# EAGLE design rev_5 (EAGLE 5.10)

## Sheet 1 of 3
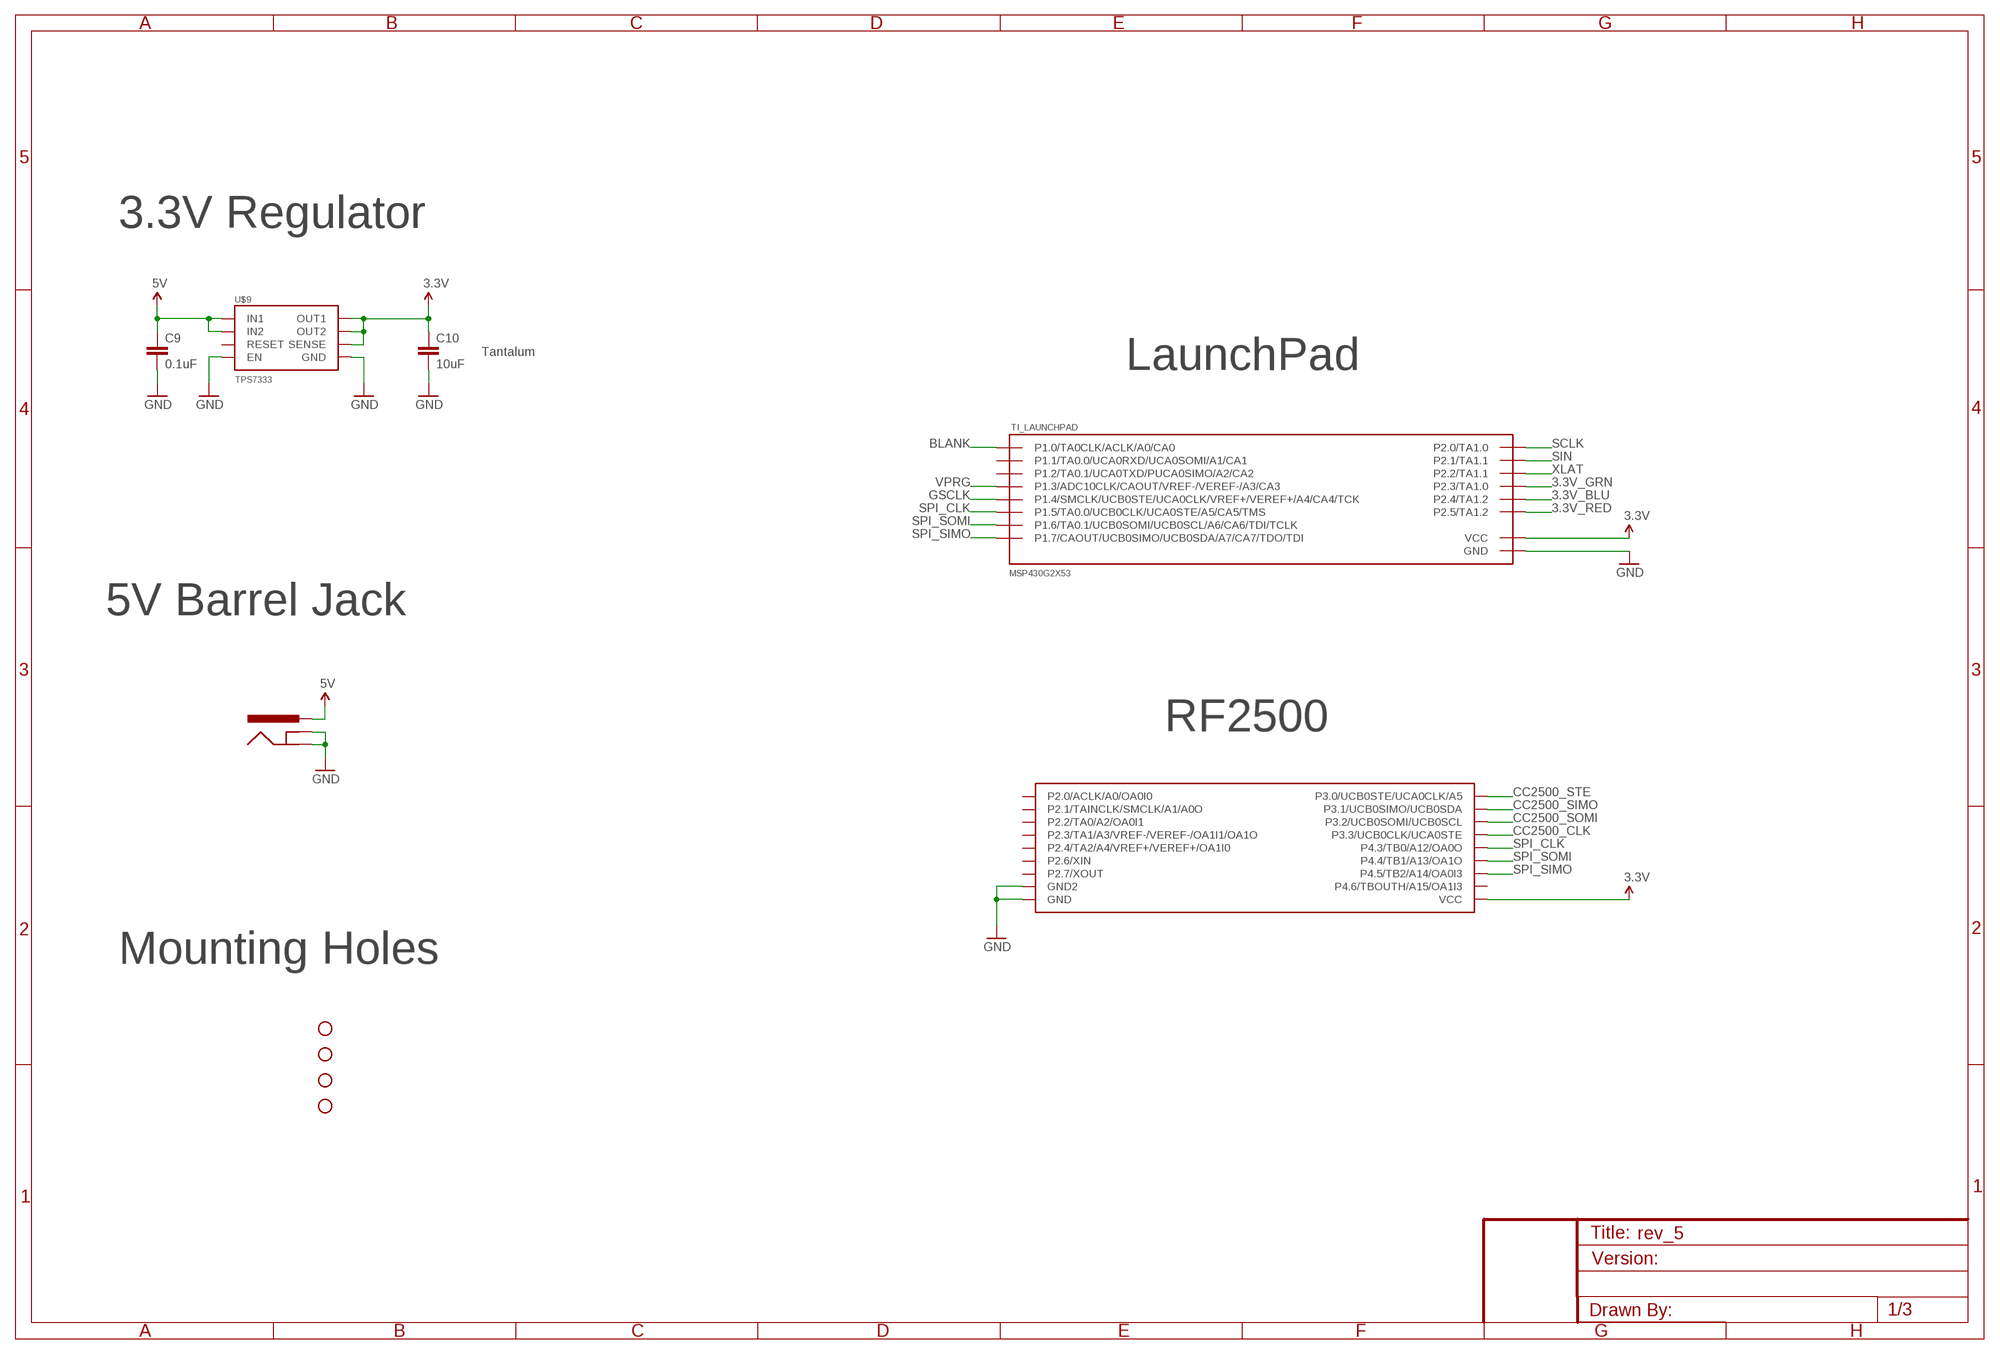
[diagram p0: schematic, sheet 1]

### Parts
C9  0.1uF  CAPPTH  [CAP-PTH-SMALL]
C10  10uF  CAPPTH  [CAP-PTH-SMALL]
JP25  STAND-OFF  [STAND-OFF]
JP26  STAND-OFF  [STAND-OFF]
JP27  STAND-OFF  [STAND-OFF]
JP28  STAND-OFF  [STAND-OFF]
MSP430G2X53  TI_LAUNCHPAD  [TI_LAUNCHPAD]
U$9  TPS7333  [TPS7333]
U$11  CP-102B-ND  [CP-102B-ND]
U$20  RF2500  [RF2500]

### Nets
3.3V: C10.1 MSP430G2X53.VCC U$9.5(OUT1) U$9.6(OUT2) U$9.7(SENSE) U$20.P$2(VCC)
3.3V_BLU: MSP430G2X53.P2.4(P2.4/TA1.2) ; also sheet 3
3.3V_GRN: MSP430G2X53.P2.3(P2.3/TA1.0) ; also sheet 3
3.3V_RED: MSP430G2X53.P2.5(P2.5/TA1.2) ; also sheet 3
5V: C9.1 U$9.3(IN1) U$9.4(IN2) U$11.1(+) ; also sheet 2,3
BLANK: MSP430G2X53.P1.0(P1.0/TA0CLK/ACLK/A0/CA0) ; also sheet 2
CC2500_CLK: U$20.P$16(P3.3/UCB0CLK/UCA0STE)
CC2500_SIMO: U$20.P$18(P3.1/UCB0SIMO/UCB0SDA)
CC2500_SOMI: U$20.P$15(P3.2/UCB0SOMI/UCB0SCL)
CC2500_STE: U$20.P$17(P3.0/UCB0STE/UCA0CLK/A5)
GND: C9.2 C10.2 MSP430G2X53.GND U$9.1(GND) U$9.2(EN) U$11.2(-) U$11.3 U$20.P$1(GND) U$20.P$12(GND2) ; also sheet 2,3
GSCLK: MSP430G2X53.P1.4(P1.4/SMCLK/UCB0STE/UCA0CLK/VREF+/VEREF+/A4/CA4/TCK) ; also sheet 2
SCLK: MSP430G2X53.P2.0(P2.0/TA1.0) ; also sheet 2
SIN: MSP430G2X53.P2.1(P2.1/TA1.1) ; also sheet 2
SPI_CLK: MSP430G2X53.P1.5(P1.5/TA0.0/UCB0CLK/UCA0STE/A5/CA5/TMS) U$20.P$8(P4.3/TB0/A12/OA0O)
SPI_SIMO: MSP430G2X53.P1.7(P1.7/CAOUT/UCB0SIMO/UCB0SDA/A7/CA7/TDO/TDI) U$20.P$10(P4.5/TB2/A14/OA0I3)
SPI_SOMI: MSP430G2X53.P1.6(P1.6/TA0.1/UCB0SOMI/UCB0SCL/A6/CA6/TDI/TCLK) U$20.P$9(P4.4/TB1/A13/OA1O)
VPRG: MSP430G2X53.P1.3(P1.3/ADC10CLK/CAOUT/VREF-/VEREF-/A3/CA3) ; also sheet 2
XLAT: MSP430G2X53.P2.2(P2.2/TA1.1) ; also sheet 2
Unconnected: MSP430G2X53.P1.1(P1.1/TA0.0/UCA0RXD/UCA0SOMI/A1/CA1) MSP430G2X53.P1.2(P1.2/TA0.1/UCA0TXD/PUCA0SIMO/A2/CA2) U$9.8(RESET) U$20.P$3(P2.0/ACLK/A0/OA0I0) U$20.P$4(P2.1/TAINCLK/SMCLK/A1/A0O) U$20.P$5(P2.2/TA0/A2/OA0I1) U$20.P$6(P2.3/TA1/A3/VREF-/VEREF-/OA1I1/OA1O) U$20.P$7(P2.4/TA2/A4/VREF+/VEREF+/OA1I0) U$20.P$11(P4.6/TBOUTH/A15/OA1I3) U$20.P$13(P2.6/XIN) U$20.P$14(P2.7/XOUT)

### Notes on the sheet
- 3.3V Regulator
- Tantalum
- LaunchPad
- 5V Barrel Jack
- RF2500
- Mounting Holes

## Sheet 2 of 3
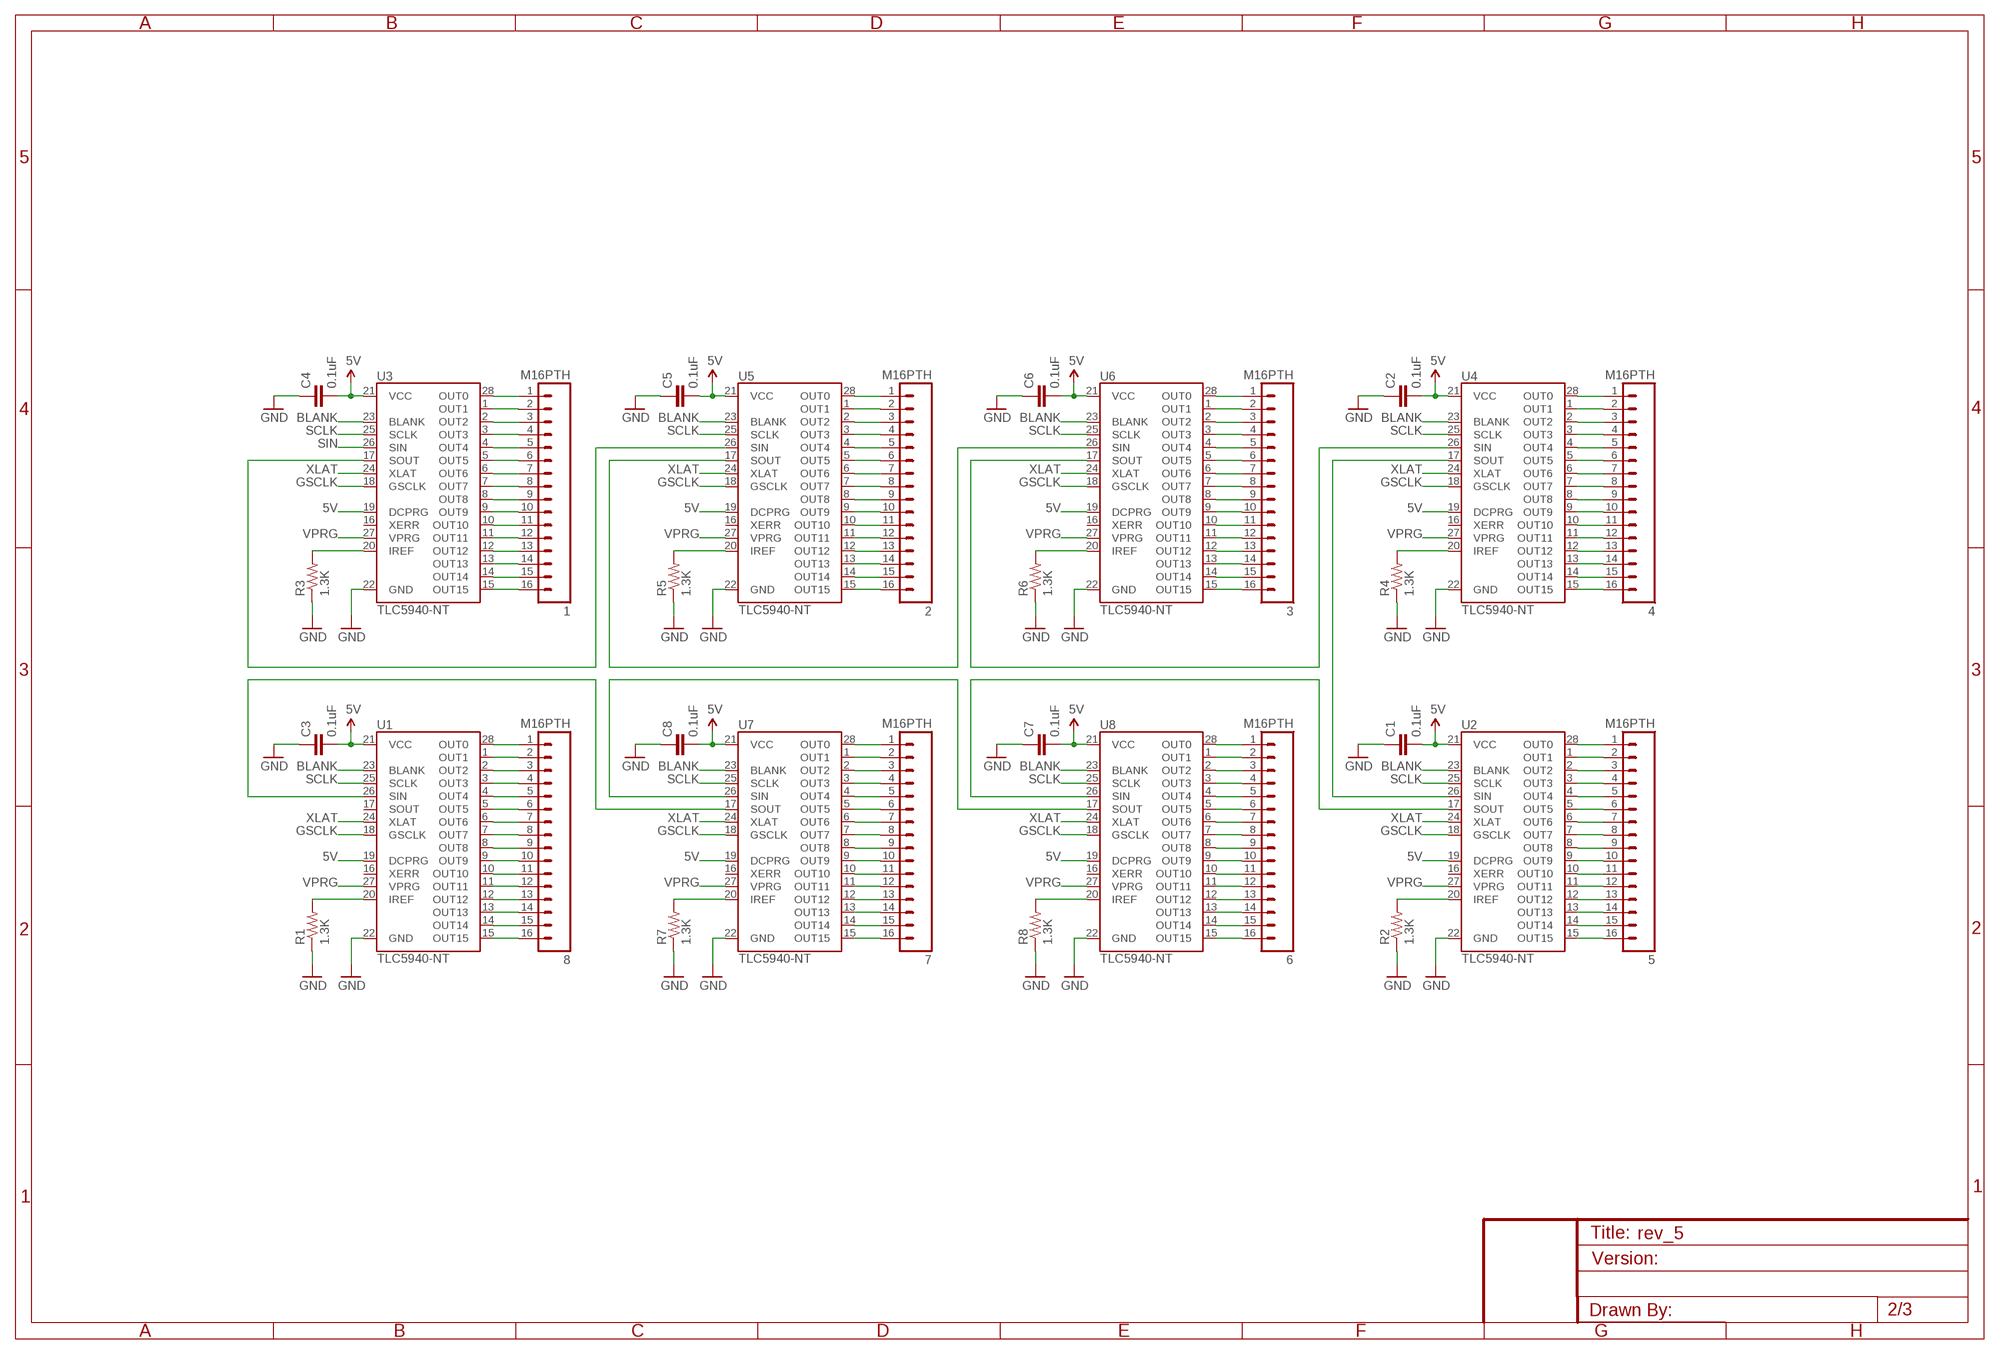
[diagram p1: schematic, sheet 2]

### Parts
1  M16PTH  [1X16]
2  M16PTH  [1X16]
3  M16PTH  [1X16]
4  M16PTH  [1X16]
5  M16PTH  [1X16]
6  M16PTH  [1X16]
7  M16PTH  [1X16]
8  M16PTH  [1X16]
C1  0.1uF  CAPPTH  [CAP-PTH-SMALL]
C2  0.1uF  CAPPTH  [CAP-PTH-SMALL]
C3  0.1uF  CAPPTH  [CAP-PTH-SMALL]
C4  0.1uF  CAPPTH  [CAP-PTH-SMALL]
C5  0.1uF  CAPPTH  [CAP-PTH-SMALL]
C6  0.1uF  CAPPTH  [CAP-PTH-SMALL]
C7  0.1uF  CAPPTH  [CAP-PTH-SMALL]
C8  0.1uF  CAPPTH  [CAP-PTH-SMALL]
R1  1.3K  RESISTORPTH-1/6W  [1/6W-RES]
R2  1.3K  RESISTORPTH-1/6W  [1/6W-RES]
R3  1.3K  RESISTORPTH-1/6W  [1/6W-RES]
R4  1.3K  RESISTORPTH-1/6W  [1/6W-RES]
R5  1.3K  RESISTORPTH-1/6W  [1/6W-RES]
R6  1.3K  RESISTORPTH-1/6W  [1/6W-RES]
R7  1.3K  RESISTORPTH-1/6W  [1/6W-RES]
R8  1.3K  RESISTORPTH-1/6W  [1/6W-RES]
U1  TLC5940-NT  [DIL28-3]
U2  TLC5940-NT  [DIL28-3]
U3  TLC5940-NT  [DIL28-3]
U4  TLC5940-NT  [DIL28-3]
U5  TLC5940-NT  [DIL28-3]
U6  TLC5940-NT  [DIL28-3]
U7  TLC5940-NT  [DIL28-3]
U8  TLC5940-NT  [DIL28-3]

### Nets
5V: C1.2 C2.2 C3.2 C4.2 C5.2 C6.2 C7.2 C8.2 U1.19(DCPRG) U1.21(VCC) U2.19(DCPRG) U2.21(VCC) U3.19(DCPRG) U3.21(VCC) U4.19(DCPRG) U4.21(VCC) U5.19(DCPRG) U5.21(VCC) U6.19(DCPRG) U6.21(VCC) U7.19(DCPRG) U7.21(VCC) U8.19(DCPRG) U8.21(VCC) ; also sheet 1,3
BLANK: U1.23(BLANK) U2.23(BLANK) U3.23(BLANK) U4.23(BLANK) U5.23(BLANK) U6.23(BLANK) U7.23(BLANK) U8.23(BLANK) ; also sheet 1
GND: C1.1 C2.1 C3.1 C4.1 C5.1 C6.1 C7.1 C8.1 R1.1 R2.1 R3.1 R4.1 R5.1 R6.1 R7.1 R8.1 U1.22(GND) U2.22(GND) U3.22(GND) U4.22(GND) U5.22(GND) U6.22(GND) U7.22(GND) U8.22(GND) ; also sheet 1,3
GSCLK: U1.18(GSCLK) U2.18(GSCLK) U3.18(GSCLK) U4.18(GSCLK) U5.18(GSCLK) U6.18(GSCLK) U7.18(GSCLK) U8.18(GSCLK) ; also sheet 1
N$1: 8.1 U1.28(OUT0)
N$2: 8.2 U1.1(OUT1)
N$3: 8.3 U1.2(OUT2)
N$4: 8.4 U1.3(OUT3)
N$5: 8.5 U1.4(OUT4)
N$6: 8.6 U1.5(OUT5)
N$7: 8.7 U1.6(OUT6)
N$8: 8.8 U1.7(OUT7)
N$9: 8.9 U1.8(OUT8)
N$10: 8.10 U1.9(OUT9)
N$11: 8.11 U1.10(OUT10)
N$12: 8.12 U1.11(OUT11)
N$13: 8.13 U1.12(OUT12)
N$14: 8.14 U1.13(OUT13)
N$15: 8.15 U1.14(OUT14)
N$16: 8.16 U1.15(OUT15)
N$17: R1.2 U1.20(IREF)
N$18: R2.2 U2.20(IREF)
N$19: 5.1 U2.28(OUT0)
N$20: 5.2 U2.1(OUT1)
N$23: 5.3 U2.2(OUT2)
N$24: 5.4 U2.3(OUT3)
N$25: 5.5 U2.4(OUT4)
N$26: 5.6 U2.5(OUT5)
N$27: 5.7 U2.6(OUT6)
N$28: 5.8 U2.7(OUT7)
N$29: 5.9 U2.8(OUT8)
N$30: 5.10 U2.9(OUT9)
N$31: 5.11 U2.10(OUT10)
N$32: 5.12 U2.11(OUT11)
N$33: 5.13 U2.12(OUT12)
N$34: 5.14 U2.13(OUT13)
N$35: 5.15 U2.14(OUT14)
N$36: 5.16 U2.15(OUT15)
N$37: U3.17(SOUT) U5.26(SIN)
N$38: U5.17(SOUT) U6.26(SIN)
N$39: R3.2 U3.20(IREF)
N$40: 1.1 U3.28(OUT0)
N$41: 1.2 U3.1(OUT1)
N$42: 1.3 U3.2(OUT2)
N$43: 1.4 U3.3(OUT3)
N$44: 1.5 U3.4(OUT4)
N$45: 1.6 U3.5(OUT5)
N$46: 1.7 U3.6(OUT6)
N$47: 1.8 U3.7(OUT7)
N$48: 1.9 U3.8(OUT8)
N$49: 1.10 U3.9(OUT9)
N$50: 1.11 U3.10(OUT10)
N$51: 1.12 U3.11(OUT11)
N$52: 1.13 U3.12(OUT12)
N$53: 1.14 U3.13(OUT13)
N$54: 1.15 U3.14(OUT14)
N$55: 1.16 U3.15(OUT15)
N$56: U4.26(SIN) U6.17(SOUT)
N$57: U2.26(SIN) U4.17(SOUT)
N$58: R4.2 U4.20(IREF)
N$59: 4.1 U4.28(OUT0)
N$60: 4.2 U4.1(OUT1)
N$61: 4.3 U4.2(OUT2)
N$62: 4.4 U4.3(OUT3)
N$63: 4.5 U4.4(OUT4)
N$64: 4.6 U4.5(OUT5)
N$65: 4.7 U4.6(OUT6)
N$66: 4.8 U4.7(OUT7)
N$67: 4.9 U4.8(OUT8)
N$68: 4.10 U4.9(OUT9)
N$69: 4.11 U4.10(OUT10)
N$70: 4.12 U4.11(OUT11)
N$71: 4.13 U4.12(OUT12)
N$72: 4.14 U4.13(OUT13)
N$73: 4.15 U4.14(OUT14)
N$74: 4.16 U4.15(OUT15)
N$75: U2.17(SOUT) U8.26(SIN)
N$77: R5.2 U5.20(IREF)
N$78: 2.1 U5.28(OUT0)
N$79: 2.2 U5.1(OUT1)
N$80: 2.3 U5.2(OUT2)
N$81: 2.4 U5.3(OUT3)
N$82: 2.5 U5.4(OUT4)
N$83: 2.6 U5.5(OUT5)
N$84: 2.7 U5.6(OUT6)
N$85: 2.8 U5.7(OUT7)
N$86: 2.9 U5.8(OUT8)
N$87: 2.10 U5.9(OUT9)
N$88: 2.11 U5.10(OUT10)
N$89: 2.12 U5.11(OUT11)
N$90: 2.13 U5.12(OUT12)
N$91: 2.14 U5.13(OUT13)
N$92: 2.15 U5.14(OUT14)
N$93: 2.16 U5.15(OUT15)
N$94: U7.26(SIN) U8.17(SOUT)
N$95: U1.26(SIN) U7.17(SOUT)
N$96: R6.2 U6.20(IREF)
N$97: 3.1 U6.28(OUT0)
N$98: 3.2 U6.1(OUT1)
N$99: 3.3 U6.2(OUT2)
N$100: 3.4 U6.3(OUT3)
N$101: 3.5 U6.4(OUT4)
N$102: 3.6 U6.5(OUT5)
N$103: 3.7 U6.6(OUT6)
N$104: 3.8 U6.7(OUT7)
N$105: 3.9 U6.8(OUT8)
N$106: 3.10 U6.9(OUT9)
N$107: 3.11 U6.10(OUT10)
N$108: 3.12 U6.11(OUT11)
N$109: 3.13 U6.12(OUT12)
N$110: 3.14 U6.13(OUT13)
N$111: 3.15 U6.14(OUT14)
N$112: 3.16 U6.15(OUT15)
N$115: R7.2 U7.20(IREF)
N$116: 7.1 U7.28(OUT0)
N$117: 7.2 U7.1(OUT1)
N$118: 7.3 U7.2(OUT2)
N$119: 7.4 U7.3(OUT3)
N$120: 7.5 U7.4(OUT4)
N$121: 7.6 U7.5(OUT5)
N$122: 7.7 U7.6(OUT6)
N$123: 7.8 U7.7(OUT7)
N$124: 7.9 U7.8(OUT8)
N$125: 7.10 U7.9(OUT9)
N$126: 7.11 U7.10(OUT10)
N$127: 7.12 U7.11(OUT11)
N$128: 7.13 U7.12(OUT12)
N$129: 7.14 U7.13(OUT13)
N$130: 7.15 U7.14(OUT14)
N$131: 7.16 U7.15(OUT15)
N$134: R8.2 U8.20(IREF)
N$135: 6.1 U8.28(OUT0)
N$136: 6.2 U8.1(OUT1)
N$137: 6.3 U8.2(OUT2)
N$138: 6.4 U8.3(OUT3)
N$139: 6.5 U8.4(OUT4)
N$140: 6.6 U8.5(OUT5)
N$141: 6.7 U8.6(OUT6)
N$142: 6.8 U8.7(OUT7)
N$143: 6.9 U8.8(OUT8)
N$144: 6.10 U8.9(OUT9)
N$145: 6.11 U8.10(OUT10)
N$146: 6.12 U8.11(OUT11)
N$147: 6.13 U8.12(OUT12)
N$148: 6.14 U8.13(OUT13)
N$149: 6.15 U8.14(OUT14)
N$150: 6.16 U8.15(OUT15)
SCLK: U1.25(SCLK) U2.25(SCLK) U3.25(SCLK) U4.25(SCLK) U5.25(SCLK) U6.25(SCLK) U7.25(SCLK) U8.25(SCLK) ; also sheet 1
SIN: U3.26(SIN) ; also sheet 1
VPRG: U1.27(VPRG) U2.27(VPRG) U3.27(VPRG) U4.27(VPRG) U5.27(VPRG) U6.27(VPRG) U7.27(VPRG) U8.27(VPRG) ; also sheet 1
XLAT: U1.24(XLAT) U2.24(XLAT) U3.24(XLAT) U4.24(XLAT) U5.24(XLAT) U6.24(XLAT) U7.24(XLAT) U8.24(XLAT) ; also sheet 1
Unconnected: U1.16(XERR) U1.17(SOUT) U2.16(XERR) U3.16(XERR) U4.16(XERR) U5.16(XERR) U6.16(XERR) U7.16(XERR) U8.16(XERR)

## Sheet 3 of 3
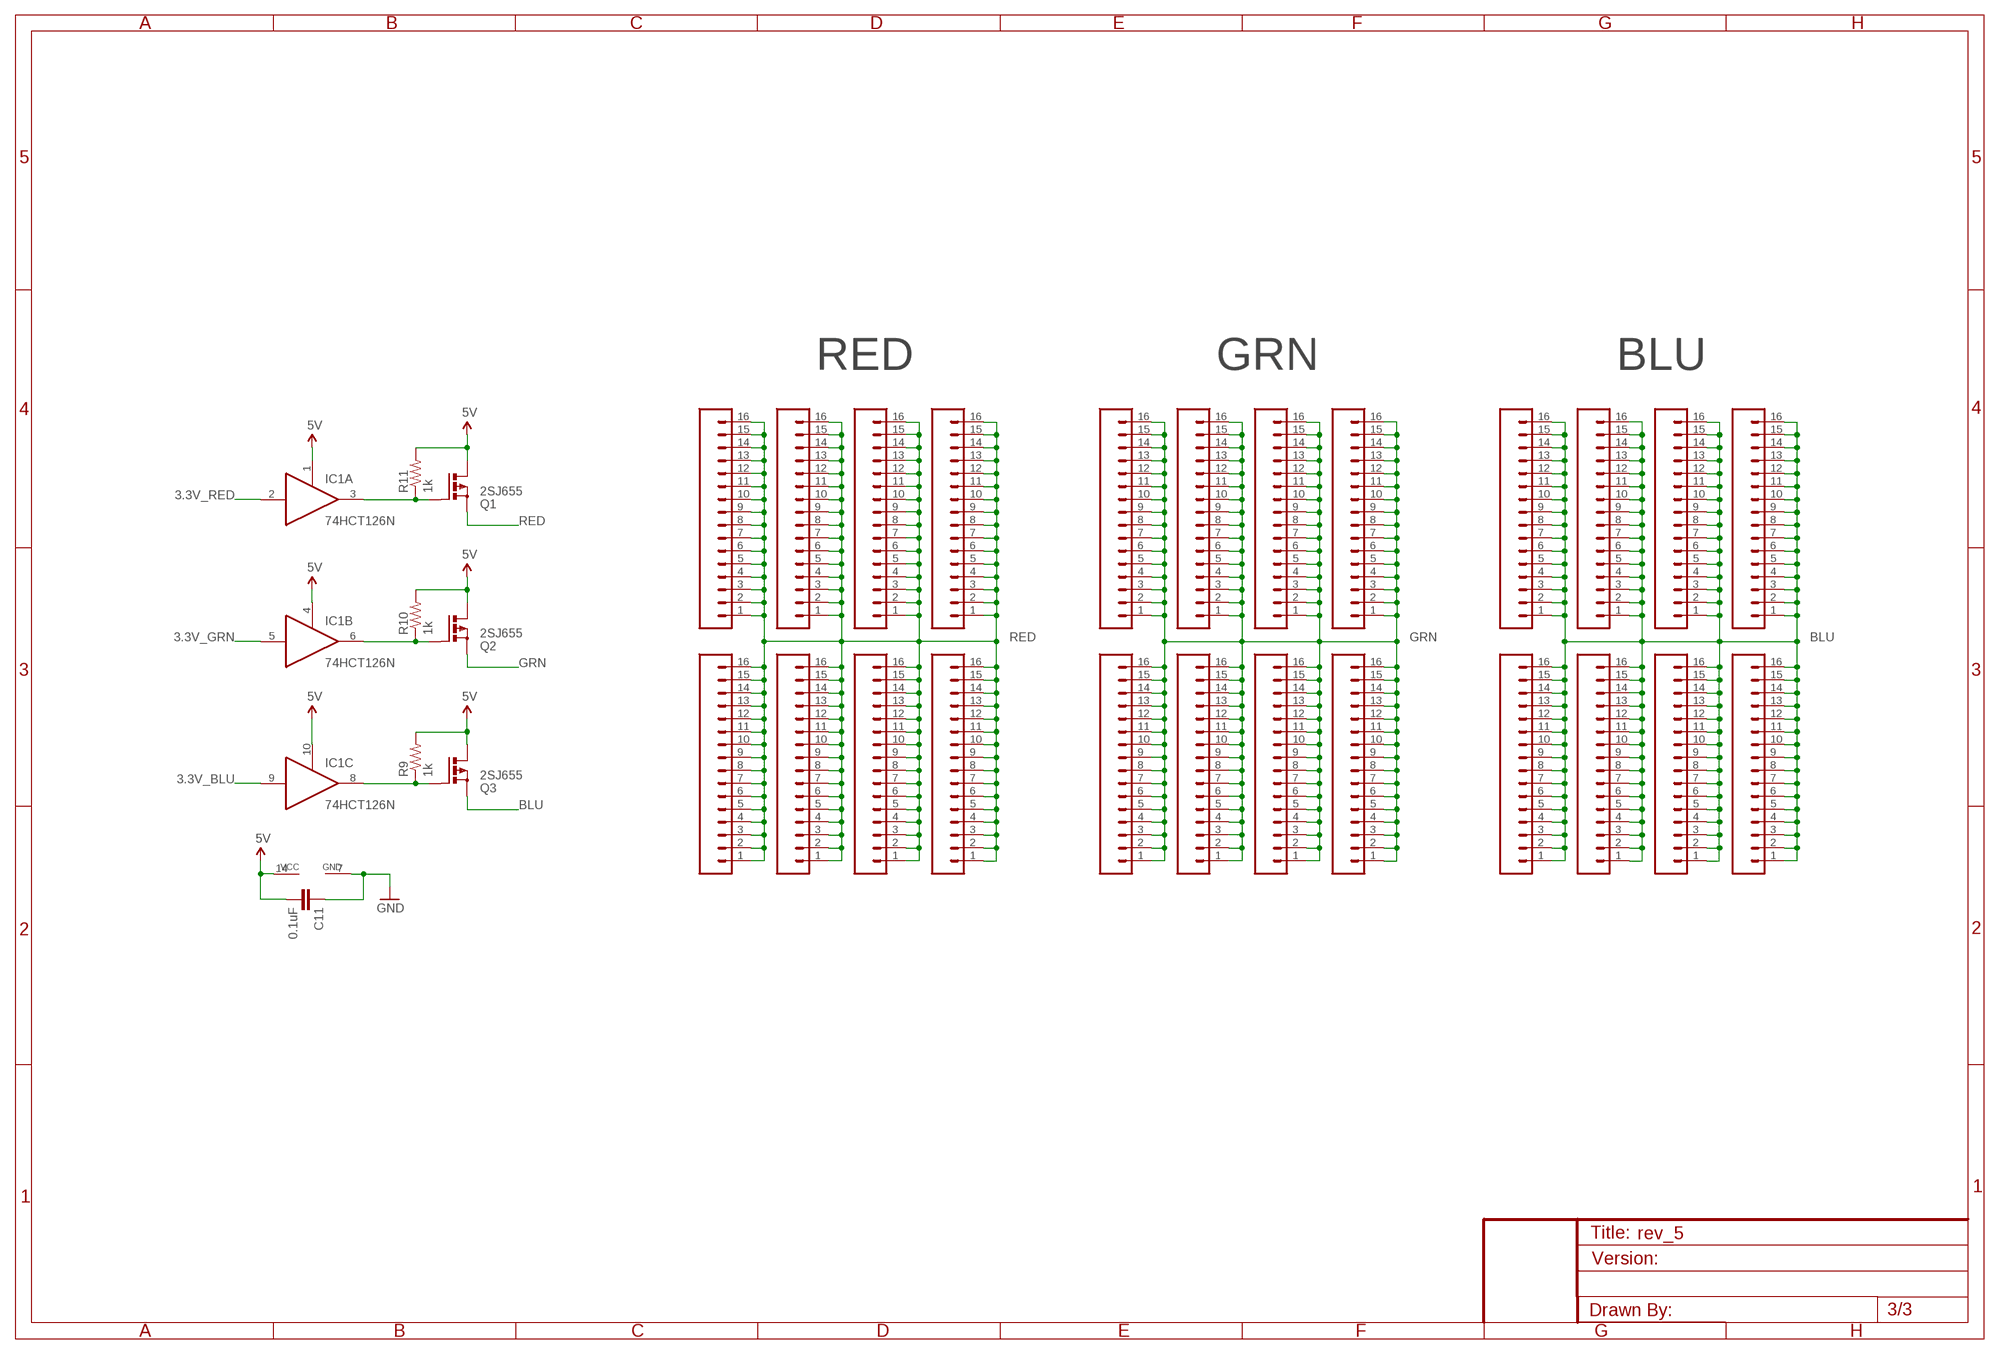
[diagram p2: schematic, sheet 3]

### Parts
C11  0.1uF  CAPPTH  [CAP-PTH-SMALL]
IC1  74HCT126N  [DIL14]
JP1  M16PTH  [1X16]
JP2  M16PTH  [1X16]
JP3  M16PTH  [1X16]
JP4  M16PTH  [1X16]
JP5  M16PTH  [1X16]
JP6  M16PTH  [1X16]
JP7  M16PTH  [1X16]
JP8  M16PTH  [1X16]
JP9  M16PTH  [1X16]
JP10  M16PTH  [1X16]
JP11  M16PTH  [1X16]
JP12  M16PTH  [1X16]
JP13  M16PTH  [1X16]
JP14  M16PTH  [1X16]
JP15  M16PTH  [1X16]
JP16  M16PTH  [1X16]
JP17  M16PTH  [1X16]
JP18  M16PTH  [1X16]
JP19  M16PTH  [1X16]
JP20  M16PTH  [1X16]
JP21  M16PTH  [1X16]
JP22  M16PTH  [1X16]
JP23  M16PTH  [1X16]
JP24  M16PTH  [1X16]
Q1  2SJ655  PMOSFET_PTO220BV  [TO220BV]
Q2  2SJ655  PMOSFET_PTO220BV  [TO220BV]
Q3  2SJ655  PMOSFET_PTO220BV  [TO220BV]
R9  1k  RESISTORPTH-1/6W  [1/6W-RES]
R10  1k  RESISTORPTH-1/6W  [1/6W-RES]
R11  1k  RESISTORPTH-1/6W  [1/6W-RES]

### Nets
3.3V_BLU: IC1.9(C:I) ; also sheet 1
3.3V_GRN: IC1.5(B:I) ; also sheet 1
3.3V_RED: IC1.2(A:I) ; also sheet 1
5V: C11.2 IC1.1(A:OE) IC1.4(B:OE) IC1.10(C:OE) IC1.14(P:VCC) Q1.D Q2.D Q3.D R9.2 R10.2 R11.2 ; also sheet 1,2
BLU: JP1.1 JP1.2 JP1.3 JP1.4 JP1.5 JP1.6 JP1.7 JP1.8 JP1.9 JP1.10 JP1.11 JP1.12 JP1.13 JP1.14 JP1.15 JP1.16 JP4.1 JP4.2 JP4.3 JP4.4 JP4.5 JP4.6 JP4.7 JP4.8 JP4.9 JP4.10 JP4.11 JP4.12 JP4.13 JP4.14 JP4.15 JP4.16 JP7.1 JP7.2 JP7.3 JP7.4 JP7.5 JP7.6 JP7.7 JP7.8 JP7.9 JP7.10 JP7.11 JP7.12 JP7.13 JP7.14 JP7.15 JP7.16 JP10.1 JP10.2 JP10.3 JP10.4 JP10.5 JP10.6 JP10.7 JP10.8 JP10.9 JP10.10 JP10.11 JP10.12 JP10.13 JP10.14 JP10.15 JP10.16 JP13.1 JP13.2 JP13.3 JP13.4 JP13.5 JP13.6 JP13.7 JP13.8 JP13.9 JP13.10 JP13.11 JP13.12 JP13.13 JP13.14 JP13.15 JP13.16 JP16.1 JP16.2 JP16.3 JP16.4 JP16.5 JP16.6 JP16.7 JP16.8 JP16.9 JP16.10 JP16.11 JP16.12 JP16.13 JP16.14 JP16.15 JP16.16 JP20.1 JP20.2 JP20.3 JP20.4 JP20.5 JP20.6 JP20.7 JP20.8 JP20.9 JP20.10 JP20.11 JP20.12 JP20.13 JP20.14 JP20.15 JP20.16 JP23.1 JP23.2 JP23.3 JP23.4 JP23.5 JP23.6 JP23.7 JP23.8 JP23.9 JP23.10 JP23.11 JP23.12 JP23.13 JP23.14 JP23.15 JP23.16 Q3.S
GND: C11.1 IC1.7(P:GND) ; also sheet 1,2
GRN: JP2.1 JP2.2 JP2.3 JP2.4 JP2.5 JP2.6 JP2.7 JP2.8 JP2.9 JP2.10 JP2.11 JP2.12 JP2.13 JP2.14 JP2.15 JP2.16 JP5.1 JP5.2 JP5.3 JP5.4 JP5.5 JP5.6 JP5.7 JP5.8 JP5.9 JP5.10 JP5.11 JP5.12 JP5.13 JP5.14 JP5.15 JP5.16 JP8.1 JP8.2 JP8.3 JP8.4 JP8.5 JP8.6 JP8.7 JP8.8 JP8.9 JP8.10 JP8.11 JP8.12 JP8.13 JP8.14 JP8.15 JP8.16 JP11.1 JP11.2 JP11.3 JP11.4 JP11.5 JP11.6 JP11.7 JP11.8 JP11.9 JP11.10 JP11.11 JP11.12 JP11.13 JP11.14 JP11.15 JP11.16 JP14.1 JP14.2 JP14.3 JP14.4 JP14.5 JP14.6 JP14.7 JP14.8 JP14.9 JP14.10 JP14.11 JP14.12 JP14.13 JP14.14 JP14.15 JP14.16 JP17.1 JP17.2 JP17.3 JP17.4 JP17.5 JP17.6 JP17.7 JP17.8 JP17.9 JP17.10 JP17.11 JP17.12 JP17.13 JP17.14 JP17.15 JP17.16 JP19.1 JP19.2 JP19.3 JP19.4 JP19.5 JP19.6 JP19.7 JP19.8 JP19.9 JP19.10 JP19.11 JP19.12 JP19.13 JP19.14 JP19.15 JP19.16 JP22.1 JP22.2 JP22.3 JP22.4 JP22.5 JP22.6 JP22.7 JP22.8 JP22.9 JP22.10 JP22.11 JP22.12 JP22.13 JP22.14 JP22.15 JP22.16 Q2.S
N$113: IC1.3(A:O) Q1.G R11.1
N$114: IC1.6(B:O) Q2.G R10.1
N$132: IC1.8(C:O) Q3.G R9.1
RED: JP3.1 JP3.2 JP3.3 JP3.4 JP3.5 JP3.6 JP3.7 JP3.8 JP3.9 JP3.10 JP3.11 JP3.12 JP3.13 JP3.14 JP3.15 JP3.16 JP6.1 JP6.2 JP6.3 JP6.4 JP6.5 JP6.6 JP6.7 JP6.8 JP6.9 JP6.10 JP6.11 JP6.12 JP6.13 JP6.14 JP6.15 JP6.16 JP9.1 JP9.2 JP9.3 JP9.4 JP9.5 JP9.6 JP9.7 JP9.8 JP9.9 JP9.10 JP9.11 JP9.12 JP9.13 JP9.14 JP9.15 JP9.16 JP12.1 JP12.2 JP12.3 JP12.4 JP12.5 JP12.6 JP12.7 JP12.8 JP12.9 JP12.10 JP12.11 JP12.12 JP12.13 JP12.14 JP12.15 JP12.16 JP15.1 JP15.2 JP15.3 JP15.4 JP15.5 JP15.6 JP15.7 JP15.8 JP15.9 JP15.10 JP15.11 JP15.12 JP15.13 JP15.14 JP15.15 JP15.16 JP18.1 JP18.2 JP18.3 JP18.4 JP18.5 JP18.6 JP18.7 JP18.8 JP18.9 JP18.10 JP18.11 JP18.12 JP18.13 JP18.14 JP18.15 JP18.16 JP21.1 JP21.2 JP21.3 JP21.4 JP21.5 JP21.6 JP21.7 JP21.8 JP21.9 JP21.10 JP21.11 JP21.12 JP21.13 JP21.14 JP21.15 JP21.16 JP24.1 JP24.2 JP24.3 JP24.4 JP24.5 JP24.6 JP24.7 JP24.8 JP24.9 JP24.10 JP24.11 JP24.12 JP24.13 JP24.14 JP24.15 JP24.16 Q1.S
Unconnected: IC1.11(D:O) IC1.12(D:I) IC1.13(D:OE)

### Notes on the sheet
- RED | GRN | BLU

## Library data of the parts
1-8 JP1-JP24 = SparkFun:M16
C1-C11 = SparkFun:CAP: Capacitor Standard 0603 ceramic capacitor, and 0.1" leaded capacitor.
IC1 = 74xx-eu:74*126: Quad bus BUFFER, 3-state
JP25-JP28 = SparkFun:STAND-OFF: Stand Off This is the mechanical footprint for a #4 phillips button head screw. Use the keepout ring to avoid running the screw head into surrounding components. SKU : PRT-00447
MSP430G2X53 = launchpad_comp:TI_LAUNCHPAD
Q1-Q3 = transistor-power:PMOSFET_P: Power MOSFET P-Channel
R1-R11 = SparkFun:RESISTOR: Resistor Basic schematic elements and footprints for 0603, 1206, and PTH resistors.
U1-U8 = SparkFun:TLC5940: TI TLC5940 16-channel LED Driver with Dot Correction and Grayscale PWM Control The TLC5940 is a 16-channel, constant-current sink LED driver. Each channel has an individually adjustable 4096-step grayscale PWM brightness control and a 64-step, constant-current sink (dot correction). The dot correction adjusts the brightness variations between LED channels and other LED drivers. The dot correction data is stored in an integrated EEPROM. Both grayscale control and dot correction are accessible via a serial interface. A single external resistor sets the maximum current value of all 16 channels. Packages: 28-pin HTSSOP 32-pin 5x5mm QFN 28-pin DIP
U$9 = launchpad_comp:TPS7333
U$11 = launchpad_comp:CP-102B-ND
U$20 = launchpad_comp:RF2500

## Board
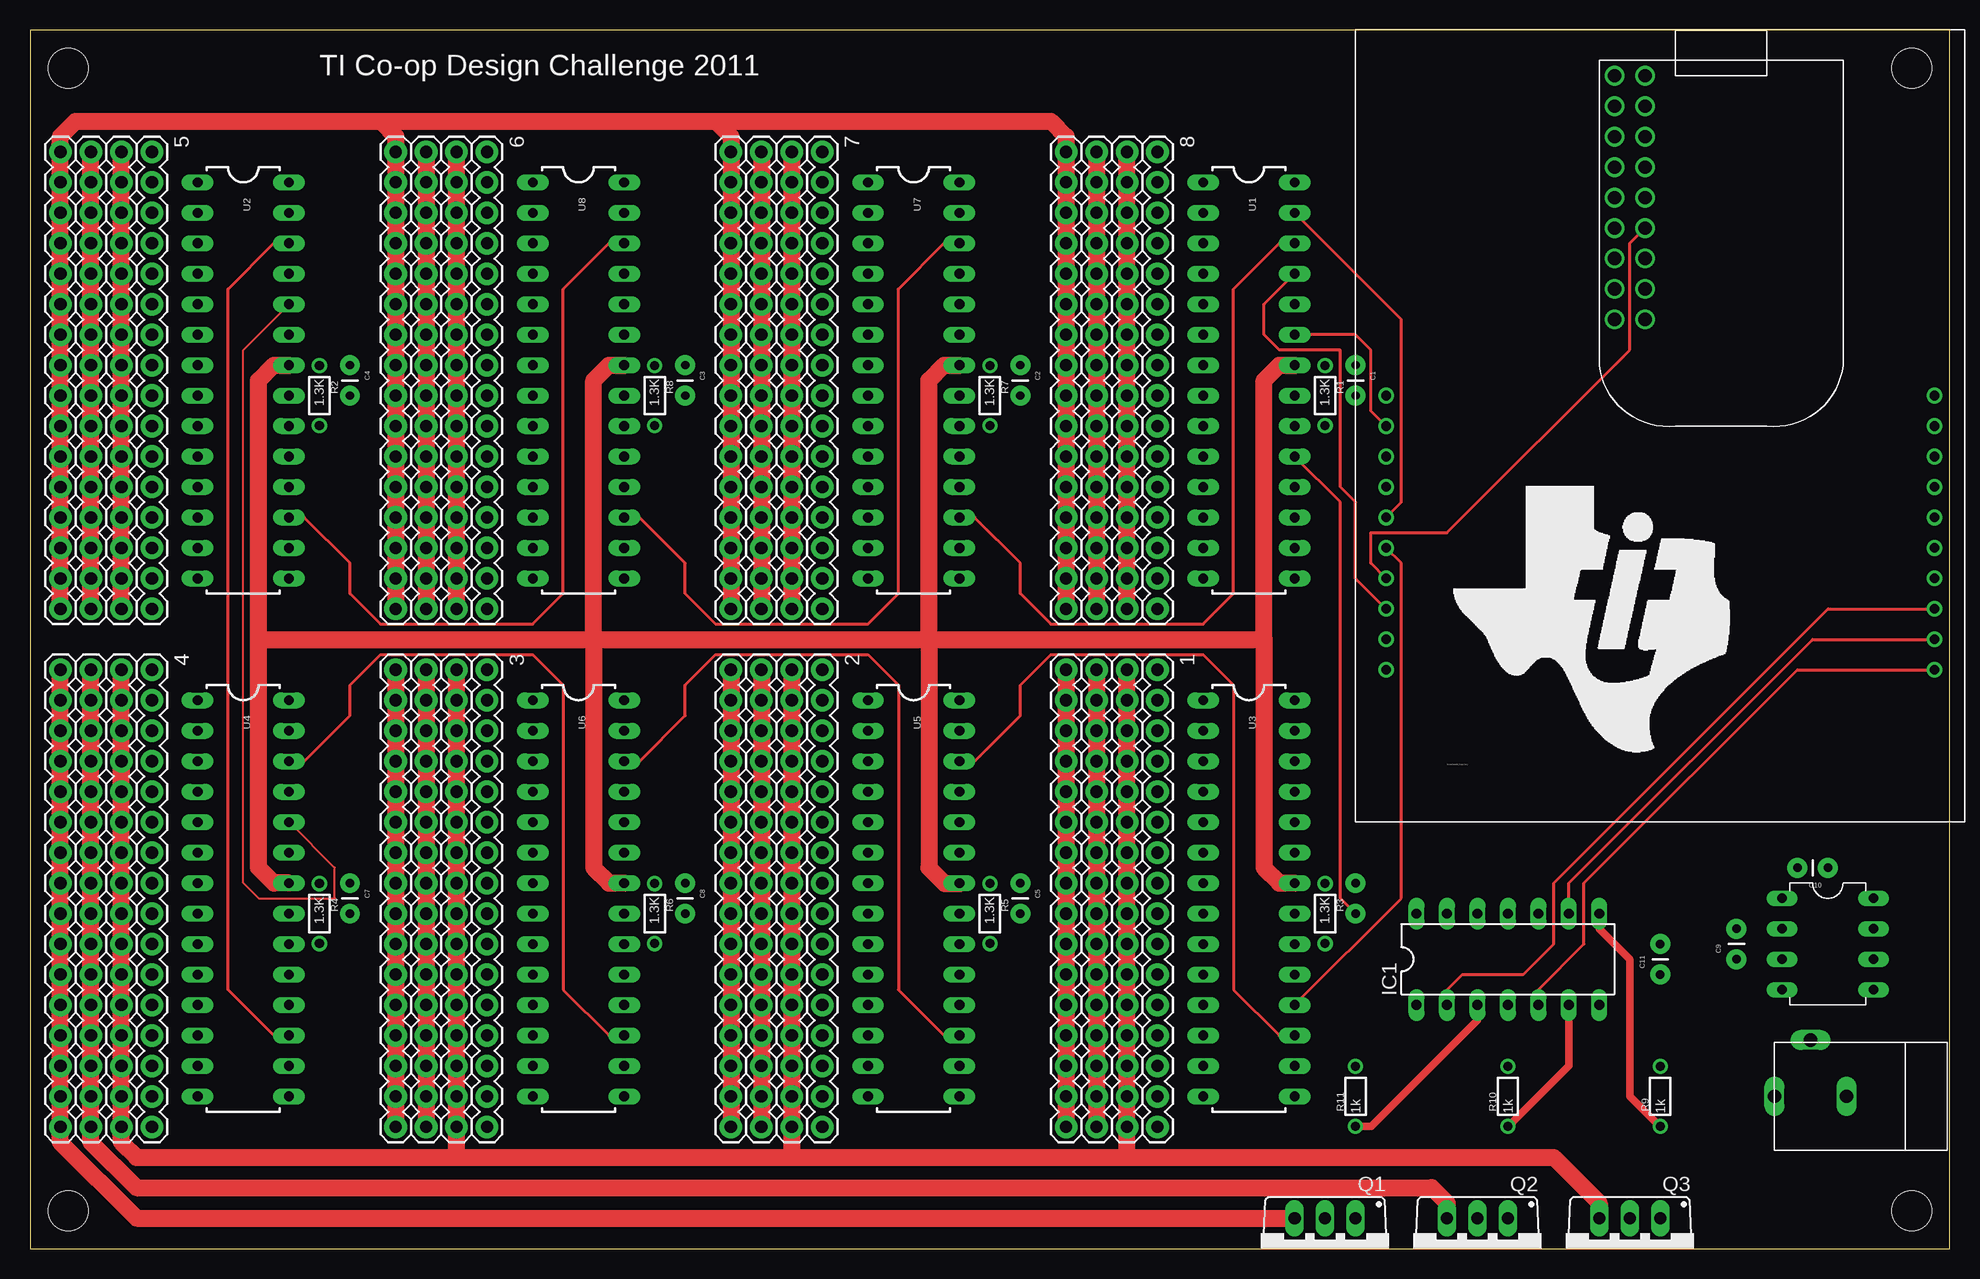
[diagram p3: board, top side]
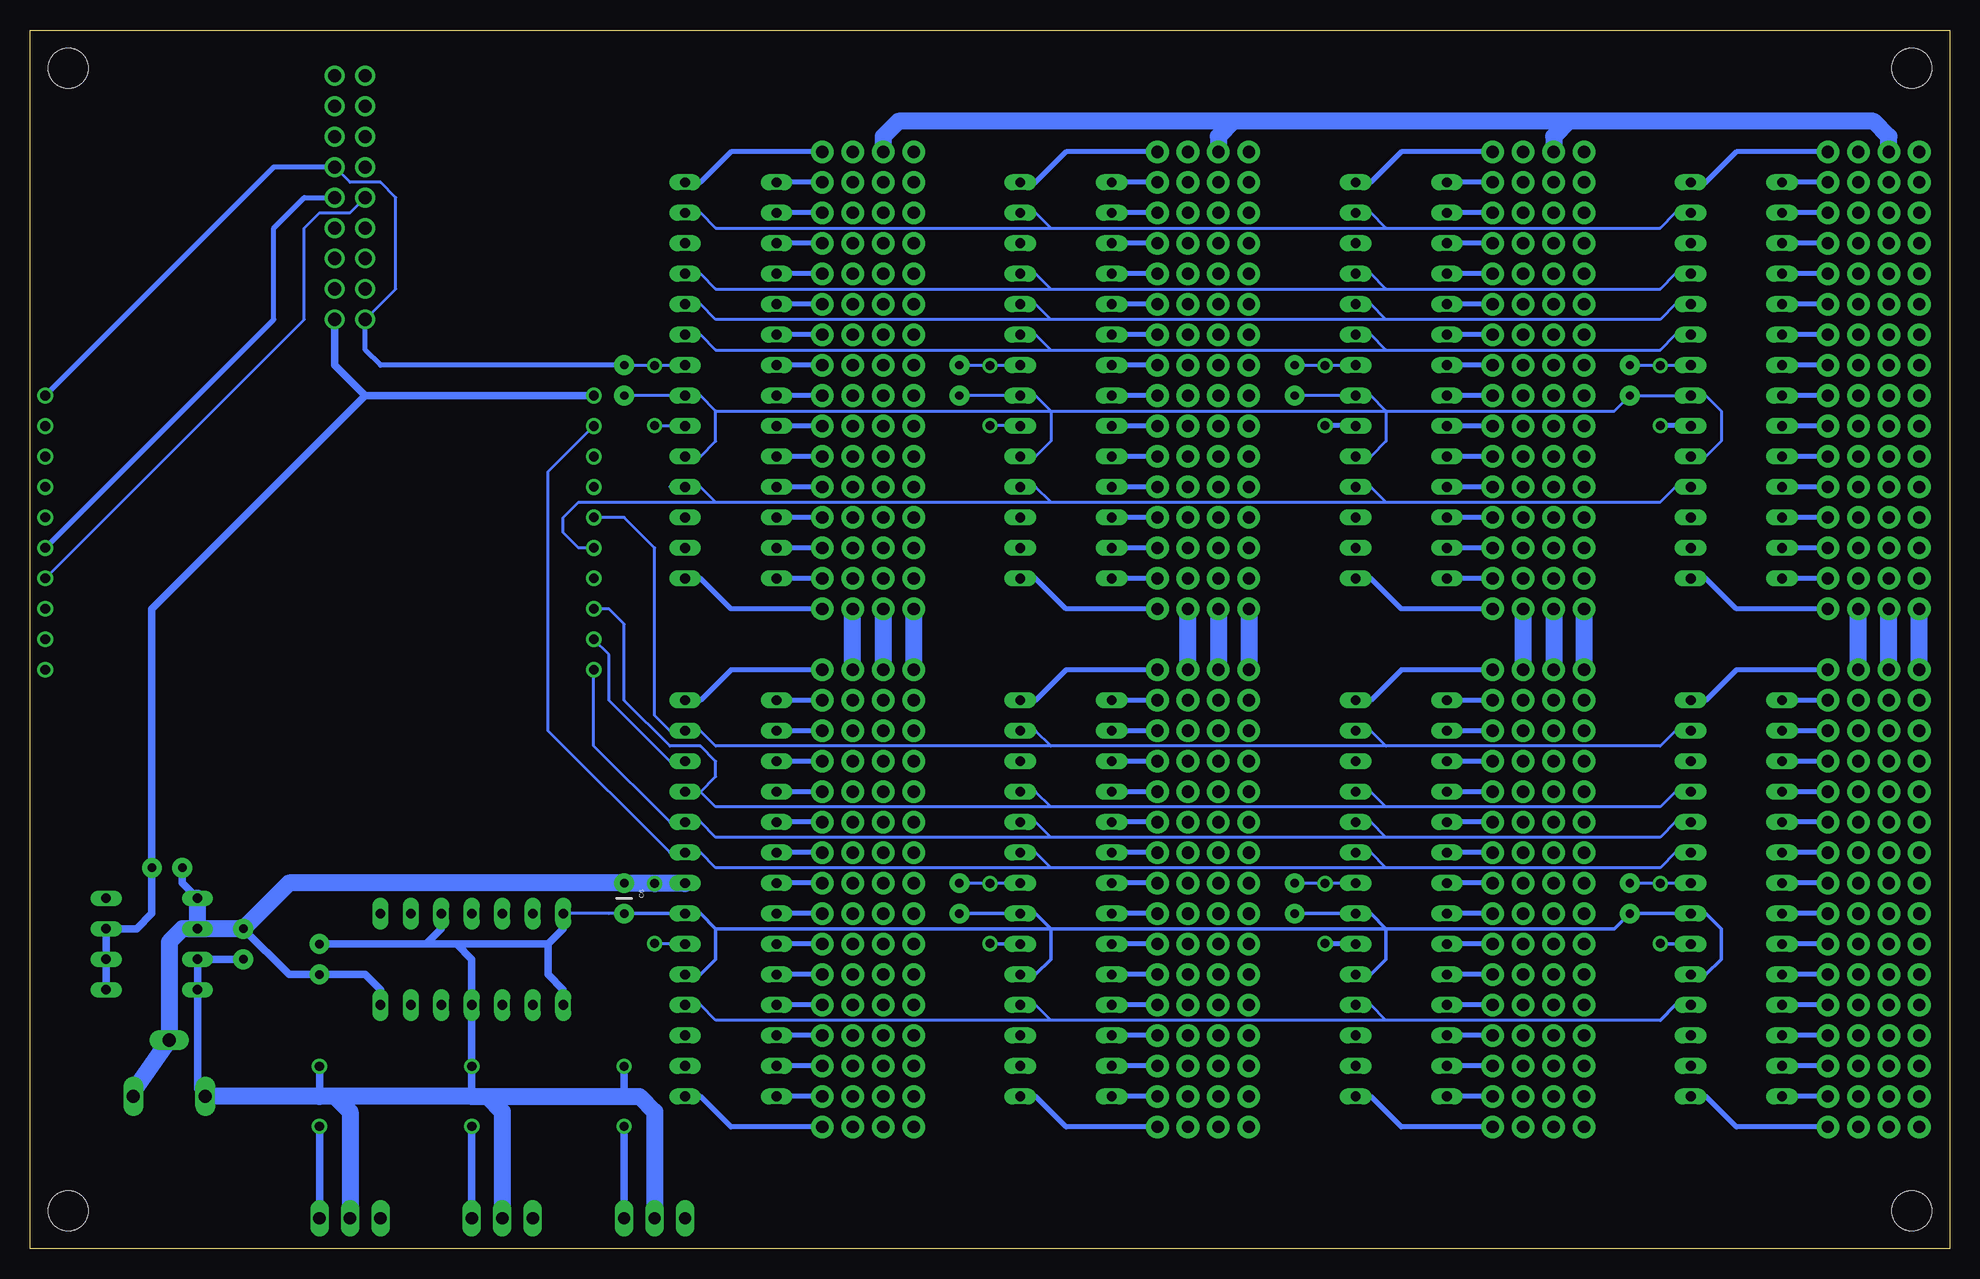
[diagram p4: board, bottom side, seen from below]

Size 160.02 x 101.6 mm. Coordinates in mm from the lower left corner, seen from the top.
Outline: 0,0 160.02,0 160.02,101.6 0,101.6 0,0
Copper layers (1*16): Top 0.0356mm / dielectric 1.5011mm / Bottom 0.0356mm
Design rules "SilverCircuits": minimum track width 7mil, minimum drill 14mil, track to track 7mil, track to pad 7mil, pad to pad 7mil, via to via 7mil, smd to smd 0mil, copper to edge 20mil, drill to drill 8mil, minimum pad ring 10mil, minimum via ring 8mil, stop-mask expansion 4mil, vias tented up to drill 0mil, thermal gap 10mil

### Footprints (pad centres in the part's own frame; a part is rotated, then mirrored left to right if it is on the bottom)
1X16 = drill 1.016 pad 1.88 round: 1 0,0; 2 2.54,0; 3 5.08,0; 4 7.62,0; 5 10.16,0; 6 12.7,0; 7 15.24,0; 8 17.78,0; 9 20.32,0; 10 22.86,0; 11 25.4,0; 12 27.94,0; 13 30.48,0; 14 33.02,0; 15 35.56,0; 16 38.1,0
CAP-PTH-SMALL = drill 0.7 pad 1.651 round: 1 0,0; 2 2.54,0
DIL14 = drill 0.813 long: 1 -7.62,-3.81; 2 -5.08,-3.81; 3 -2.54,-3.81; 4 0,-3.81; 5 2.54,-3.81; 6 5.08,-3.81; 7 7.62,-3.81; 8 7.62,3.81; 9 5.08,3.81; 10 2.54,3.81; 11 0,3.81; 12 -2.54,3.81; 13 -5.08,3.81; 14 -7.62,3.81
STAND-OFF = hole 3.302: 0,0
TI_LAUNCHPAD = drill 0.8 round: GND 48.26,35.56; P1.0 2.54,33.02; P1.1 2.54,30.48; P1.2 2.54,27.94; P1.3 2.54,25.4; P1.4 2.54,22.86; P1.5 2.54,20.32; P1.6 48.26,20.32; P1.7 48.26,22.86; P2.0 2.54,17.78; P2.1 2.54,15.24; P2.2 2.54,12.7; P2.3 48.26,12.7; P2.4 48.26,15.24; P2.5 48.26,17.78; RST 48.26,25.4; TEST 48.26,27.94; VCC 2.54,35.56; XIN 48.26,33.02; XOUT 48.26,30.48
TO220BV = drill 1.016 long: D 0,-2.54; G -2.54,-2.54; S 2.54,-2.54
1/6W-RES = drill 0.762 round: 1 -2.5,0; 2 2.5,0
DIL28-3 = drill 0.813 long: 1 -16.51,-3.81; 2 -13.97,-3.81; 3 -11.43,-3.81; 4 -8.89,-3.81; 5 -6.35,-3.81; 6 -3.81,-3.81; 7 -1.27,-3.81; 8 1.27,-3.81; 9 3.81,-3.81; 10 6.35,-3.81; 11 8.89,-3.81; 12 11.43,-3.81; 13 13.97,-3.81; 14 16.51,-3.81; 15 16.51,3.81; 16 13.97,3.81; 17 11.43,3.81; 18 8.89,3.81; 19 6.35,3.81; 20 3.81,3.81; 21 1.27,3.81; 22 -1.27,3.81; 23 -3.81,3.81; 24 -6.35,3.81; 25 -8.89,3.81; 26 -11.43,3.81; 27 -13.97,3.81; 28 -16.51,3.81
TPS7333 = drill 0.8 long: 1 -3.81,3.81; 2 -3.81,1.27; 3 -3.81,-1.27; 4 -3.81,-3.81; 5 3.81,-3.81; 6 3.81,-1.27; 7 3.81,1.27; 8 3.81,3.81
CP-102B-ND = drill 1.1 long: 1 0,0; 2 0,5.994; 3 -4.699,2.997
RF2500 = drill 1.1 round: P$1 0,0; P$2 2.54,0; P$3 0,2.54; P$4 2.54,2.54; P$5 0,5.08; P$6 2.54,5.08; P$7 0,7.62; P$8 2.54,7.62; P$9 0,10.16; P$10 2.54,10.16; P$11 0,12.7; P$12 2.54,12.7; P$13 0,15.24; P$14 2.54,15.24; P$15 0,17.78; P$16 2.54,17.78; P$17 0,20.32; P$18 2.54,20.32

### Placement (x,y rotation side)
1  93.98,48.26 270 top
2  66.04,48.26 270 top
3  38.1,48.26 270 top
4  10.16,48.26 270 top
5  10.16,91.44 270 top
6  38.1,91.44 270 top
7  66.04,91.44 270 top
8  93.98,91.44 270 top
C1  110.49,73.66 270 top
C2  82.55,73.66 270 top
C3  54.61,73.66 270 top
C4  26.67,73.66 270 top
C5  82.55,30.48 270 top
C6  110.49,30.48 270 bottom
C7  26.67,30.48 270 top
C8  54.61,30.48 270 top
C9  142.24,24.13 90 top
C10  149.86,31.75 180 top
C11  135.89,22.86 90 top
IC1  123.19,24.13 0 top
JP1  7.62,91.44 270 top
JP2  5.08,91.44 270 top
JP3  2.54,91.44 270 top
JP4  7.62,48.26 270 top
JP5  5.08,48.26 270 top
JP6  2.54,48.26 270 top
JP7  35.56,91.44 270 top
JP8  33.02,91.44 270 top
JP9  30.48,91.44 270 top
JP10  35.56,48.26 270 top
JP11  33.02,48.26 270 top
JP12  30.48,48.26 270 top
JP13  63.5,91.44 270 top
JP14  60.96,91.44 270 top
JP15  86.36,48.26 270 top
JP16  91.44,48.26 270 top
JP17  88.9,48.26 270 top
JP18  86.36,91.44 270 top
JP19  88.9,91.44 270 top
JP20  91.44,91.44 270 top
JP21  58.42,48.26 270 top
JP22  60.96,48.26 270 top
JP23  63.5,48.26 270 top
JP24  58.42,91.44 270 top
JP25  156.84,3.17 0 top
JP26  3.17,3.17 0 top
JP27  156.84,98.42 0 top
JP28  3.17,98.42 0 top
MSP430G2X53  110.49,35.56 0 top
Q1  107.95,0 180 top
Q2  120.65,0 180 top
Q3  133.35,0 180 top
R1  107.95,71.12 270 top
R2  24.13,71.12 270 top
R3  107.95,27.94 270 top
R4  24.13,27.94 270 top
R5  80.01,27.94 270 top
R6  52.07,27.94 270 top
R7  80.01,71.12 270 top
R8  52.07,71.12 270 top
R9  135.89,12.7 90 top
R10  123.19,12.7 90 top
R11  110.49,12.7 90 top
U1  101.6,72.39 270 top
U2  17.78,72.39 270 top
U3  101.6,29.21 270 top
U4  17.78,29.21 270 top
U5  73.66,29.21 270 top
U6  45.72,29.21 270 top
U7  73.66,72.39 270 top
U8  45.72,72.39 270 top
U$9  149.86,25.4 0 top
U$11  145.41,12.7 270 top
U$20  132.08,77.47 0 top
U$21  [TI_LOGO]  118.11,40.64 0 top

### Tracks (layer width: path | path; a pad name or v marks a point on that pad's centre or on a via)
3.3V
  Bottom 0.61: U$9.5 U$9.6 U$9.7 151.13,26.67 149.86,27.94 C10.1 149.86,53.34 132.08,71.12 | U$20.P$2 134.62,73.66 132.08,71.12 | 132.08,71.12 MSP430G2X53.VCC
3.3V_BLU
  Top 0.254: IC1.9 128.27,30.48 148.59,50.8 MSP430G2X53.P2.4
3.3V_GRN
  Top 0.254: IC1.5 125.73,21.59 129.54,25.4 129.54,30.48 147.32,48.26 MSP430G2X53.P2.3
3.3V_RED
  Top 0.254: IC1.2 118.11,21.59 119.38,22.86 124.46,22.86 127,25.4 127,30.48 149.86,53.34 MSP430G2X53.P2.5
5V
  Top 0.254: U1.19 109.22,62.23 109.22,29.21 C6.2
  Bottom 0.254: 74.93,69.85 46.99,69.85 | 102.87,69.85 74.93,69.85 | 102.87,69.85 104.14,71.12 U1.21 C1.2 | 74.93,69.85 76.2,71.12 U7.21 C2.2 | 46.99,69.85 48.26,71.12 U8.21 C3.2 | 76.2,27.94 U5.21 | U1.19 104.14,66.04 102.87,67.31 102.87,69.85 | U7.19 76.2,66.04 74.93,67.31 74.93,69.85 | U8.19 48.26,66.04 46.99,67.31 46.99,69.85 | U2.19 20.32,66.04 19.05,67.31 19.05,69.85 20.32,71.12 U2.21 C4.2 27.94,69.85 46.99,69.85 | C6.2 IC1.14 | U3.21 111.76,27.94
  Bottom 0.305: 46.99,26.67 74.93,26.67 | 74.93,26.67 102.87,26.67 | 102.87,26.67 104.14,27.94 U3.21 C6.2 | 74.93,26.67 76.2,27.94 | 46.99,26.67 48.26,27.94 U6.21 C8.2 | U6.19 48.26,22.86 46.99,24.13 46.99,26.67 | U5.19 76.2,22.86 74.93,24.13 74.93,26.67 | U3.19 104.14,22.86 102.87,24.13 102.87,26.67 | U5.21 C5.2 | 46.99,26.67 27.94,26.67 C7.2 U4.21 20.32,27.94 19.05,26.67 19.05,24.13 20.32,22.86 U4.19
  Bottom 0.61: 110.49,12.7 R11.2 | 123.19,12.7 R10.2 IC1.4 123.19,24.13 124.46,25.4 | 135.89,12.7 R9.2 | IC1.1 115.57,21.59 116.84,22.86 116.84,25.4 | IC1.14 115.57,26.67 116.84,25.4 | IC1.10 125.73,26.67 127,25.4 | 116.84,25.4 124.46,25.4 | 124.46,25.4 127,25.4 | 127,25.4 C11.2 | C9.1 U$9.3 U$9.4 146.05,13.34 U$11.1
  Bottom 1.422: Q1.D 107.95,11.43 109.22,12.7 110.49,12.7 121.92,12.7 | 121.92,12.7 123.19,12.7 134.62,12.7 | 134.62,12.7 135.89,12.7 U$11.1 | Q2.D 120.65,11.43 121.92,12.7 | Q3.D 133.35,11.43 134.62,12.7
BLANK
  Top 0.254: U1.23 110.49,76.2 111.76,74.93 111.76,69.85 MSP430G2X53.P1.0
  Bottom 0.254: U2.23 22.86,76.2 24.13,74.93 46.99,74.93 | 74.93,74.93 46.99,74.93 | 74.93,74.93 102.87,74.93 104.14,76.2 U1.23 | U7.23 76.2,76.2 74.93,74.93 | U8.23 48.26,76.2 46.99,74.93 | U4.23 22.86,33.02 24.13,31.75 46.99,31.75 | 46.99,31.75 74.93,31.75 | 74.93,31.75 102.87,31.75 104.14,33.02 U3.23 106.68,33.02 116.84,43.18 116.84,64.77 MSP430G2X53.P1.0 | U5.23 76.2,33.02 74.93,31.75 | U6.23 48.26,33.02 46.99,31.75
BLU
  Top 1.422: JP1.1 JP1.2 JP1.3 JP1.4 JP1.5 JP1.6 JP1.7 JP1.8 JP1.9 JP1.10 JP1.11 JP1.12 JP1.13 JP1.14 JP1.15 JP1.16 | JP4.1 JP4.2 JP4.3 JP4.4 | JP4.4 7.62,39.37 | JP4.4 JP4.5 JP4.6 JP4.7 JP4.8 JP4.9 JP4.10 JP4.11 JP4.12 JP4.13 JP4.14 JP4.15 JP4.16 7.62,8.89 8.89,7.62 35.56,7.62 | JP10.1 JP10.2 JP10.3 JP10.4 JP10.5 JP10.6 JP10.7 JP10.8 JP10.9 JP10.10 JP10.11 JP10.12 JP10.13 JP10.14 JP10.15 JP10.16 35.56,7.62 | JP7.16 JP7.15 JP7.14 JP7.13 JP7.12 JP7.11 JP7.10 JP7.9 JP7.8 JP7.7 JP7.6 JP7.5 JP7.4 JP7.3 JP7.2 JP7.1 | JP13.1 JP13.2 JP13.3 JP13.4 JP13.5 JP13.6 JP13.7 JP13.8 JP13.9 JP13.10 JP13.11 JP13.12 JP13.13 JP13.14 JP13.15 JP13.16 | JP23.1 JP23.2 JP23.3 JP23.4 JP23.5 JP23.6 JP23.7 JP23.8 JP23.9 JP23.10 JP23.11 JP23.12 JP23.13 JP23.14 JP23.15 JP23.16 63.5,7.62 | JP16.1 JP16.2 JP16.3 JP16.4 JP16.5 JP16.6 JP16.7 JP16.8 JP16.9 JP16.10 JP16.11 JP16.12 JP16.13 JP16.14 JP16.15 JP16.16 91.44,7.62 | JP20.16 JP20.15 JP20.14 JP20.13 JP20.12 JP20.11 JP20.10 JP20.9 JP20.8 JP20.7 JP20.6 JP20.5 JP20.4 JP20.3 JP20.2 JP20.1 | 35.56,7.62 63.5,7.62 | 63.5,7.62 91.44,7.62 | 91.44,7.62 127,7.62 130.81,3.81 Q3.S
  Bottom 1.422: JP4.1 JP1.16 | JP10.1 JP7.16 | JP16.1 JP20.16 | JP23.1 JP13.16
GND
  Top 0.178: 77.47,30.44 U5.22
  Top 1.422: U4.22 20.32,30.48 19.05,31.75 19.05,50.8 | 19.05,50.8 19.05,72.39 20.32,73.66 U2.22 | U6.22 48.26,30.48 46.99,31.75 46.99,50.8 | 46.99,50.8 46.99,72.39 48.26,73.66 U8.22 | U3.22 104.14,30.48 102.87,31.75 102.87,50.8 | 102.87,50.8 102.87,72.39 104.14,73.66 U1.22 | 77.47,30.44 76.24,30.44 74.93,31.75 74.93,50.8 | 74.93,50.8 74.93,72.39 76.2,73.66 U7.22 | 19.05,50.8 46.99,50.8 | 46.99,50.8 74.93,50.8 | 74.93,50.8 102.87,50.8
  Bottom 0.254: U4.22 21.63,30.44 R4.1 26.63,30.44 C7.1 | U2.22 21.63,73.62 R2.1 26.63,73.62 C4.1 | U8.22 49.57,73.62 R8.1 54.57,73.62 C3.1 | U6.22 49.57,30.44 R6.1 54.57,30.44 C8.1 | U5.22 77.51,30.44 R5.1 82.51,30.44 C5.1 | U7.22 77.51,73.62 R7.1 82.51,73.62 C2.1 | U1.22 105.45,73.62 R1.1 110.45,73.62 C1.1 | U3.22 105.45,30.44 | U$20.P$1 129.54,80.01 129.54,87.63 130.81,88.9 133.35,88.9 U$20.P$12
  Bottom 0.406: U2.22 21.59,73.62 | U$20.P$1 132.08,74.93 130.81,73.66 C1.1 | MSP430G2X53.GND 139.7,90.17 U$20.P$12
  Bottom 0.61: C10.2 147.32,30.48 U$9.1 | IC1.7 130.81,21.59 132.08,22.86 C11.1 138.43,22.86 C9.2
  Bottom 1.422: U$11.2 151.41,13.13 U$11.3 148.41,25.58 147.32,26.67 U$9.2 | U$9.2 U$9.1 | U$9.2 C9.2 138.43,30.48 C6.1 110.45,30.44 R3.1 105.45,30.44
GRN
  Top 1.422: JP2.1 JP2.2 JP2.3 JP2.4 JP2.5 JP2.6 JP2.7 JP2.8 JP2.9 JP2.10 JP2.11 JP2.12 JP2.13 JP2.14 JP2.15 JP2.16 | JP5.1 JP5.2 JP5.3 | JP5.3 5.08,41.91 | JP5.3 JP5.4 JP5.5 JP5.6 JP5.7 JP5.8 JP5.9 JP5.10 JP5.11 JP5.12 JP5.13 JP5.14 JP5.15 JP5.16 5.08,8.89 8.89,5.08 116.84,5.08 118.11,3.81 Q2.S | JP8.1 JP8.2 JP8.3 JP8.4 JP8.5 JP8.6 JP8.7 JP8.8 | JP8.8 33.02,72.39 | JP8.8 JP8.9 JP8.10 JP8.11 JP8.12 JP8.13 JP8.14 JP8.15 JP8.16 | JP11.1 JP11.2 JP11.3 JP11.4 JP11.5 JP11.6 JP11.7 JP11.8 JP11.9 JP11.10 JP11.11 JP11.12 JP11.13 JP11.14 JP11.15 JP11.16 | JP22.16 JP22.15 JP22.14 JP22.13 JP22.12 JP22.11 JP22.10 JP22.9 JP22.8 JP22.7 JP22.6 JP22.5 JP22.4 JP22.3 JP22.2 JP22.1 | JP14.16 JP14.15 JP14.14 JP14.13 JP14.12 JP14.11 JP14.10 JP14.9 JP14.8 JP14.7 JP14.6 JP14.5 JP14.4 JP14.3 JP14.2 JP14.1 | JP19.1 JP19.2 JP19.3 JP19.4 JP19.5 JP19.6 JP19.7 JP19.8 JP19.9 JP19.10 JP19.11 JP19.12 JP19.13 JP19.14 JP19.15 JP19.16 | JP17.1 JP17.2 JP17.3 JP17.4 JP17.5 JP17.6 JP17.7 JP17.8 JP17.9 JP17.10 JP17.11 JP17.12 JP17.13 JP17.14 JP17.15 JP17.16
  Bottom 1.422: JP5.1 JP2.16 | JP8.16 JP11.1 | JP19.16 JP17.1 | JP14.16 JP22.1 | JP2.1 5.08,92.71 6.35,93.98 31.75,93.98 | 31.75,93.98 33.02,92.71 JP8.1 | 31.75,93.98 59.69,93.98 | 59.69,93.98 87.63,93.98 88.9,92.71 JP19.1 | JP14.1 60.96,92.71 59.69,93.98
GSCLK
  Top 0.254: U3.18 114.3,29.21 114.3,57.15 MSP430G2X53.P1.4
  Bottom 0.254: U2.18 22.86,63.5 24.13,62.23 46.99,62.23 | 74.93,62.23 46.99,62.23 | U8.18 48.26,63.5 46.99,62.23 | 24.13,19.05 46.99,19.05 | 46.99,19.05 74.93,19.05 | 74.93,19.05 102.87,19.05 104.14,20.32 U3.18 | U6.18 48.26,20.32 46.99,19.05 | 102.87,62.23 104.14,63.5 U1.18 106.68,63.5 | 102.87,62.23 74.93,62.23 | 74.93,62.23 76.2,63.5 U7.18 | U5.18 76.2,20.32 74.93,19.05 | MSP430G2X53.P1.4 114.3,58.42 115.57,59.69 115.57,60.96 114.3,62.23 102.87,62.23
  Bottom 0.305: U4.18 22.86,20.32 24.13,19.05
N$1
  Bottom 0.406: U1.28 104.14,88.9 101.6,91.44 8.1
N$2
  Bottom 0.406: 8.2 U1.1
N$3
  Bottom 0.406: 8.3 U1.2
N$4
  Bottom 0.406: 8.4 U1.3
N$5
  Bottom 0.406: 8.5 U1.4
N$6
  Bottom 0.406: 8.6 U1.5
N$7
  Bottom 0.406: 8.7 U1.6
N$8
  Bottom 0.406: 8.8 U1.7
N$9
  Bottom 0.406: 8.9 U1.8
N$10
  Bottom 0.406: 8.10 U1.9
N$11
  Bottom 0.406: 8.11 U1.10
N$12
  Bottom 0.406: 8.12 U1.11
N$13
  Bottom 0.406: 8.13 U1.12
N$14
  Bottom 0.406: 8.14 U1.13
N$15
  Bottom 0.406: 8.15 U1.14
N$16
  Bottom 0.406: U1.15 104.14,55.88 101.6,53.34 8.16
N$17
  Bottom 0.254: U1.20 107.91,68.58 R1.2
N$18
  Bottom 0.406: U2.20 21.59,68.62 R2.2
N$19
  Bottom 0.406: U2.28 20.32,88.9 17.78,91.44 5.1
N$20
  Bottom 0.406: 5.2 U2.1
N$23
  Bottom 0.406: 5.3 U2.2
N$24
  Bottom 0.406: 5.4 U2.3
N$25
  Bottom 0.406: 5.5 U2.4
N$26
  Bottom 0.406: 5.6 U2.5
N$27
  Bottom 0.406: 5.7 U2.6
N$28
  Bottom 0.406: 5.8 U2.7
N$29
  Bottom 0.406: 5.9 U2.8
N$30
  Bottom 0.406: 5.10 U2.9
N$31
  Bottom 0.406: 5.11 U2.10
N$32
  Bottom 0.406: 5.12 U2.11
N$33
  Bottom 0.406: 5.13 U2.12
N$34
  Bottom 0.406: 5.14 U2.13
N$35
  Bottom 0.406: 5.15 U2.14
N$36
  Bottom 0.406: U2.15 20.32,55.88 17.78,53.34 5.16
N$37
  Top 0.254: U3.17 104.14,17.78 100.33,21.59 100.33,46.99 97.79,49.53 85.09,49.53 82.55,46.99 82.55,44.45 78.74,40.64 U5.26
N$38
  Top 0.254: U5.17 76.2,17.78 72.39,21.59 72.39,46.99 69.85,49.53 57.15,49.53 54.61,46.99 54.61,44.45 50.8,40.64 U6.26
N$39
  Bottom 0.254: U3.20 107.91,25.4 R3.2
N$40
  Bottom 0.406: U3.28 104.14,45.72 101.6,48.26 1.1
N$41
  Bottom 0.406: 1.2 U3.1
N$42
  Bottom 0.406: 1.3 U3.2
N$43
  Bottom 0.406: 1.4 U3.3
N$44
  Bottom 0.406: 1.5 U3.4
N$45
  Bottom 0.406: 1.6 U3.5
N$46
  Bottom 0.406: 1.7 U3.6
N$47
  Bottom 0.406: 1.8 U3.7
N$48
  Bottom 0.406: 1.9 U3.8
N$49
  Bottom 0.406: 1.10 U3.9
N$50
  Bottom 0.406: 1.11 U3.10
N$51
  Bottom 0.406: 1.12 U3.11
N$52
  Bottom 0.406: 1.13 U3.12
N$53
  Bottom 0.406: 1.14 U3.13
N$54
  Bottom 0.406: 1.15 U3.14
N$55
  Bottom 0.406: U3.15 104.14,12.7 101.6,10.16 1.16
N$56
  Top 0.254: U6.17 48.26,17.78 44.45,21.59 44.45,46.99 41.91,49.53 29.21,49.53 26.67,46.99 26.67,44.45 22.86,40.64 U4.26
N$57
  Top 0.254: U2.26 20.32,83.82 16.51,80.01 16.51,21.59 20.32,17.78 U4.17
N$58
  Bottom 0.254: 24.09,25.4 R4.2
  Bottom 0.305: U4.20 24.09,25.4
N$59
  Bottom 0.406: U4.28 20.32,45.72 17.78,48.26 4.1
N$60
  Bottom 0.406: 4.2 U4.1
N$61
  Bottom 0.406: 4.3 U4.2
N$62
  Bottom 0.406: 4.4 U4.3
N$63
  Bottom 0.406: 4.5 U4.4
N$64
  Bottom 0.406: 4.6 U4.5
N$65
  Bottom 0.406: 4.7 U4.6
N$66
  Bottom 0.406: 4.8 U4.7
N$67
  Bottom 0.406: 4.9 U4.8
N$68
  Bottom 0.406: 4.10 U4.9
N$69
  Bottom 0.406: 4.11 U4.10
N$70
  Bottom 0.406: 4.12 U4.11
N$71
  Bottom 0.406: 4.13 U4.12
N$72
  Bottom 0.406: 4.14 U4.13
N$73
  Bottom 0.406: 4.15 U4.14
N$74
  Bottom 0.406: U4.15 20.32,12.7 17.78,10.16 4.16
N$75
  Top 0.254: U8.26 48.26,83.82 44.45,80.01 44.45,54.61 41.91,52.07 29.21,52.07 26.67,54.61 26.67,57.15 22.86,60.96 U2.17
N$77
  Bottom 0.178: 80.01,25.4 R5.2
  Bottom 0.305: U5.20 80.01,25.4
N$78
  Bottom 0.406: U5.28 76.2,45.72 73.66,48.26 2.1
N$79
  Bottom 0.406: 2.2 U5.1
N$80
  Bottom 0.406: 2.3 U5.2
N$81
  Bottom 0.406: 2.4 U5.3
N$82
  Bottom 0.406: 2.5 U5.4
N$83
  Bottom 0.406: 2.6 U5.5
N$84
  Bottom 0.406: 2.7 U5.6
N$85
  Bottom 0.406: 2.8 U5.7
N$86
  Bottom 0.406: 2.9 U5.8
N$87
  Bottom 0.406: 2.10 U5.9
N$88
  Bottom 0.406: 2.11 U5.10
N$89
  Bottom 0.406: 2.12 U5.11
N$90
  Bottom 0.406: 2.13 U5.12
N$91
  Bottom 0.406: 2.14 U5.13
N$92
  Bottom 0.406: 2.15 U5.14
N$93
  Bottom 0.406: U5.15 76.2,12.7 73.66,10.16 2.16
N$94
  Top 0.254: U7.26 76.2,83.82 72.39,80.01 72.39,54.61 69.85,52.07 57.15,52.07 54.61,54.61 54.61,57.15 50.8,60.96 U8.17
N$95
  Top 0.254: U1.26 104.14,83.82 100.33,80.01 100.33,54.61 97.79,52.07 85.09,52.07 82.55,54.61 82.55,57.15 78.74,60.96 U7.17
N$96
  Bottom 0.406: R6.2 52.07,25.4 U6.20
N$97
  Bottom 0.406: U6.28 48.26,45.72 45.72,48.26 3.1
N$98
  Bottom 0.406: 3.2 U6.1
N$99
  Bottom 0.406: 3.3 U6.2
N$100
  Bottom 0.406: 3.4 U6.3
N$101
  Bottom 0.406: 3.5 U6.4
N$102
  Bottom 0.406: 3.6 U6.5
N$103
  Bottom 0.406: 3.7 U6.6
N$104
  Bottom 0.406: 3.8 U6.7
N$105
  Bottom 0.406: 3.9 U6.8
N$106
  Bottom 0.406: 3.10 U6.9
N$107
  Bottom 0.406: 3.11 U6.10
N$108
  Bottom 0.406: 3.12 U6.11
N$109
  Bottom 0.406: 3.13 U6.12
N$110
  Bottom 0.406: 3.14 U6.13
N$111
  Bottom 0.406: 3.15 U6.14
N$112
  Bottom 0.406: U6.15 48.26,12.7 45.72,10.16 3.16
N$113
  Top 0.61: R11.1 111.8,10.2 120.65,19.05 IC1.3
  Bottom 0.61: Q1.G R11.1
N$114
  Top 0.61: R10.1 123.23,10.2 128.27,15.24 IC1.6
  Bottom 0.61: Q2.G R10.1
N$115
  Bottom 0.254: R7.2 77.51,68.62 U7.20
N$116
  Bottom 0.406: U7.28 76.2,88.9 73.66,91.44 7.1
N$117
  Bottom 0.406: 7.2 U7.1
N$118
  Bottom 0.406: 7.3 U7.2
N$119
  Bottom 0.406: 7.4 U7.3
N$120
  Bottom 0.406: 7.5 U7.4
N$121
  Bottom 0.406: 7.6 U7.5
N$122
  Bottom 0.406: 7.7 U7.6
N$123
  Bottom 0.406: 7.8 U7.7
N$124
  Bottom 0.406: 7.9 U7.8
N$125
  Bottom 0.406: 7.10 U7.9
N$126
  Bottom 0.406: 7.11 U7.10
N$127
  Bottom 0.406: 7.12 U7.11
N$128
  Bottom 0.406: 7.13 U7.12
N$129
  Bottom 0.406: 7.14 U7.13
N$130
  Bottom 0.406: 7.15 U7.14
N$131
  Bottom 0.406: U7.15 76.2,55.88 73.66,53.34 7.16
N$132
  Top 0.61: R9.1 135.89,10.16 133.35,12.7 133.35,24.13 130.81,26.67 IC1.8
  Bottom 0.61: Q3.G R9.1
N$134
  Bottom 0.406: U8.20 49.53,68.62 R8.2
N$135
  Bottom 0.406: U8.28 48.26,88.9 45.72,91.44 6.1
N$136
  Bottom 0.406: 6.2 U8.1
N$137
  Bottom 0.406: 6.3 U8.2
N$138
  Bottom 0.406: 6.4 U8.3
N$139
  Bottom 0.406: 6.5 U8.4
N$140
  Bottom 0.406: 6.6 U8.5
N$141
  Bottom 0.406: 6.7 U8.6
N$142
  Bottom 0.406: 6.8 U8.7
N$143
  Bottom 0.406: 6.9 U8.8
N$144
  Bottom 0.406: 6.10 U8.9
N$145
  Bottom 0.406: 6.11 U8.10
N$146
  Bottom 0.406: 6.12 U8.11
N$147
  Bottom 0.406: 6.13 U8.12
N$148
  Bottom 0.406: 6.14 U8.13
N$149
  Bottom 0.406: 6.15 U8.14
N$150
  Bottom 0.406: U8.15 48.26,55.88 45.72,53.34 6.16
RED
  Top 1.422: JP3.16 JP3.15 JP3.14 JP3.13 JP3.12 JP3.11 JP3.10 JP3.9 JP3.8 JP3.7 JP3.6 JP3.5 JP3.4 JP3.3 JP3.2 JP3.1 2.54,92.71 3.81,93.98 29.21,93.98 | JP6.1 JP6.2 JP6.3 JP6.4 JP6.5 JP6.6 JP6.7 JP6.8 JP6.9 | JP6.9 2.54,26.67 | JP6.9 JP6.10 JP6.11 JP6.12 JP6.13 JP6.14 JP6.15 JP6.16 2.54,8.89 8.89,2.54 Q1.S | JP12.16 JP12.15 JP12.14 JP12.13 JP12.12 JP12.11 JP12.10 JP12.9 JP12.8 JP12.7 JP12.6 JP12.5 JP12.4 JP12.3 JP12.2 JP12.1 | JP9.16 JP9.15 JP9.14 JP9.13 JP9.12 JP9.11 JP9.10 JP9.9 JP9.8 JP9.7 JP9.6 JP9.5 JP9.4 JP9.3 JP9.2 JP9.1 30.48,92.71 29.21,93.98 | JP24.16 JP24.15 JP24.14 JP24.13 JP24.12 JP24.11 JP24.10 JP24.9 JP24.8 JP24.7 JP24.6 JP24.5 JP24.4 JP24.3 JP24.2 JP24.1 58.42,92.71 57.15,93.98 | JP21.1 JP21.2 JP21.3 JP21.4 JP21.5 JP21.6 JP21.7 JP21.8 JP21.9 JP21.10 JP21.11 JP21.12 JP21.13 JP21.14 JP21.15 JP21.16 | JP18.11 JP18.10 JP18.9 JP18.8 JP18.7 JP18.6 JP18.5 JP18.4 JP18.3 JP18.2 JP18.1 86.36,92.71 85.09,93.98 57.15,93.98 | JP18.11 86.36,64.77 | JP18.11 JP18.12 JP18.13 JP18.14 JP18.15 JP18.16 | JP15.1 JP15.2 JP15.3 JP15.4 JP15.5 JP15.6 JP15.7 JP15.8 JP15.9 JP15.10 JP15.11 JP15.12 JP15.13 JP15.14 JP15.15 JP15.16 | 29.21,93.98 57.15,93.98
  Bottom 1.422: JP6.1 JP3.16 | JP9.16 JP12.1 | JP18.16 JP15.1 | JP24.16 JP21.1
SCLK
  Top 0.254: U1.25 102.87,78.74 102.87,76.2 104.14,74.93 109.22,74.93 109.22,63.5 110.49,62.23 110.49,55.88 MSP430G2X53.P2.0
  Bottom 0.254: U2.25 22.86,81.28 24.13,80.01 46.99,80.01 | 74.93,80.01 46.99,80.01 | 74.93,80.01 102.87,80.01 104.14,81.28 U1.25 | U7.25 76.2,81.28 74.93,80.01 | U8.25 48.26,81.28 46.99,80.01 | U4.25 22.86,38.1 24.13,36.83 46.99,36.83 | 46.99,36.83 74.93,36.83 | 74.93,36.83 102.87,36.83 104.14,38.1 | U5.25 76.2,38.1 74.93,36.83 | U6.25 48.26,38.1 46.99,36.83 | 104.14,38.1 U3.25 | 104.14,38.1 102.87,39.37 102.87,40.64 104.14,41.91 106.68,41.91 110.49,45.72 110.49,52.07 111.76,53.34 MSP430G2X53.P2.0
SIN
  Bottom 0.254: U3.26 106.68,40.64 111.76,45.72 111.76,49.53 MSP430G2X53.P2.1
SPI_CLK
  Top 0.254: MSP430G2X53.P1.5 111.76,57.15 111.76,59.69 118.11,59.69 133.35,74.93 133.35,83.82 U$20.P$8
SPI_SIMO
  Bottom 0.406: U$20.P$10 137.16,87.63 139.7,85.09 139.7,77.47 MSP430G2X53.P1.7
SPI_SOMI
  Bottom 0.254: MSP430G2X53.P1.6 137.16,77.47 137.16,85.09 135.89,86.36 133.35,86.36 U$20.P$9
VPRG
  Top 0.254: U1.27 114.3,77.47 114.3,62.23 MSP430G2X53.P1.3
  Bottom 0.254: U2.27 22.86,86.36 24.13,85.09 46.99,85.09 | 74.93,85.09 46.99,85.09 | 74.93,85.09 102.87,85.09 104.14,86.36 U1.27 | U7.27 76.2,86.36 74.93,85.09 | U8.27 48.26,86.36 46.99,85.09 | 46.99,41.91 74.93,41.91 | 74.93,41.91 102.87,41.91 104.14,43.18 U3.27 106.68,43.18 107.95,44.45 107.95,58.42 110.49,60.96 MSP430G2X53.P1.3 | U5.27 76.2,43.18 74.93,41.91 | U6.27 48.26,43.18 46.99,41.91 | 46.99,41.91 24.13,41.91 22.86,43.18 U4.27
XLAT
  Top 0.178: U2.24 17.78,74.93 17.78,30.48 19.05,29.21 25.4,29.21 25.4,31.75 U4.24
  Bottom 0.254: U2.24 22.86,78.74 24.13,77.47 46.99,77.47 | 46.99,77.47 74.93,77.47 | 74.93,77.47 102.87,77.47 104.14,78.74 U1.24 | U7.24 76.2,78.74 74.93,77.47 | U8.24 48.26,78.74 46.99,77.47 | U4.24 22.86,35.56 24.13,34.29 46.99,34.29 | 46.99,34.29 74.93,34.29 | 74.93,34.29 102.87,34.29 104.14,35.56 U3.24 106.68,35.56 113.03,41.91 MSP430G2X53.P2.2 | U5.24 76.2,35.56 74.93,34.29 | U6.24 48.26,35.56 46.99,34.29

### Text on the board
tPlace: TI Co-op Design Challenge 2011